# EasyEDA Pro project Example_3D Shell Design.eprj, board 3D Shell Example-A
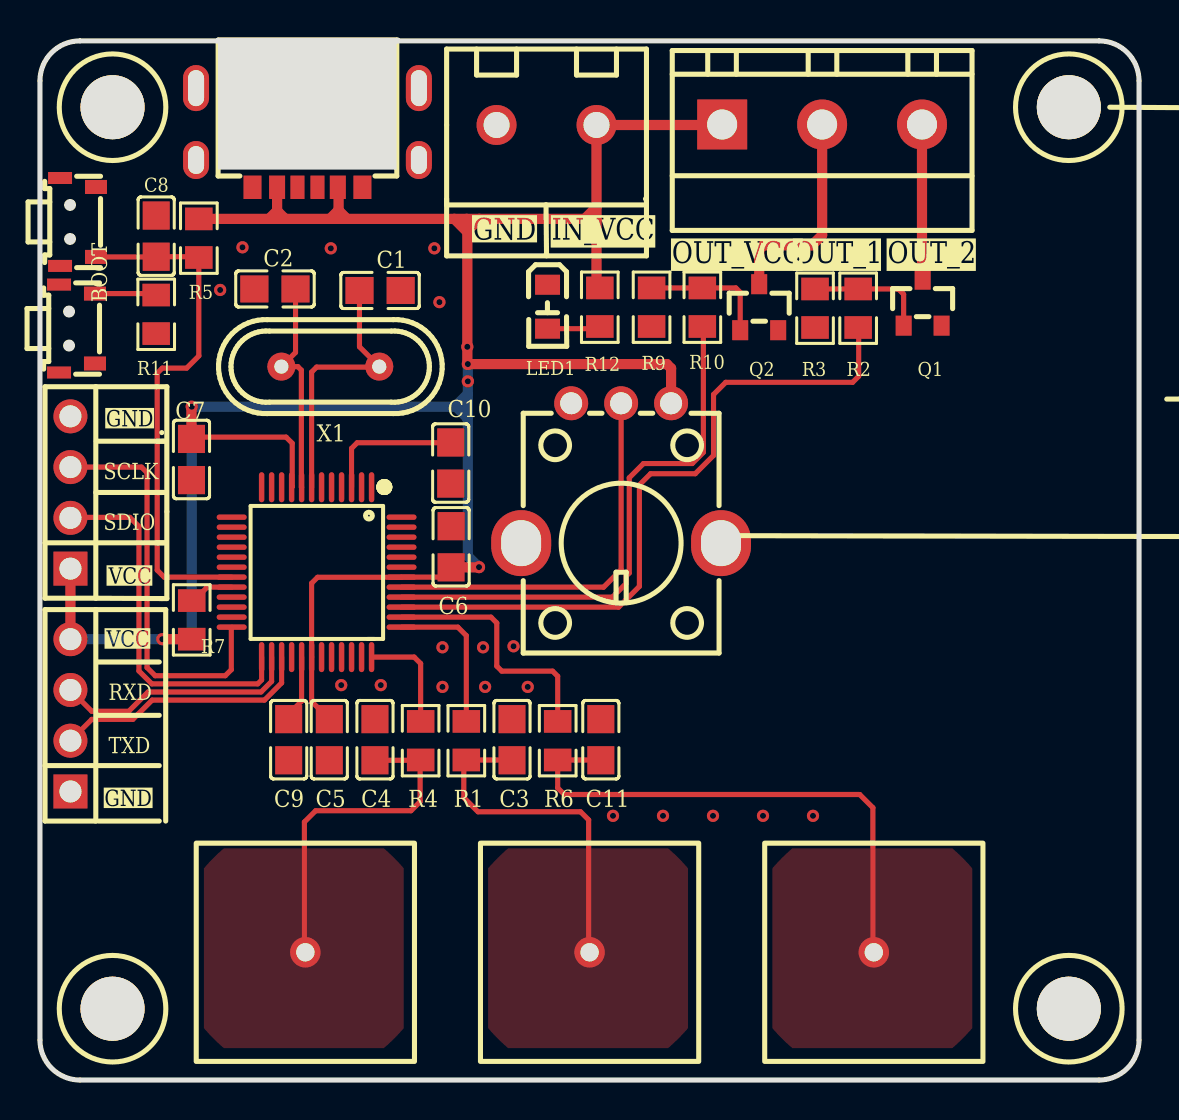
[diagram p2: board, top side]
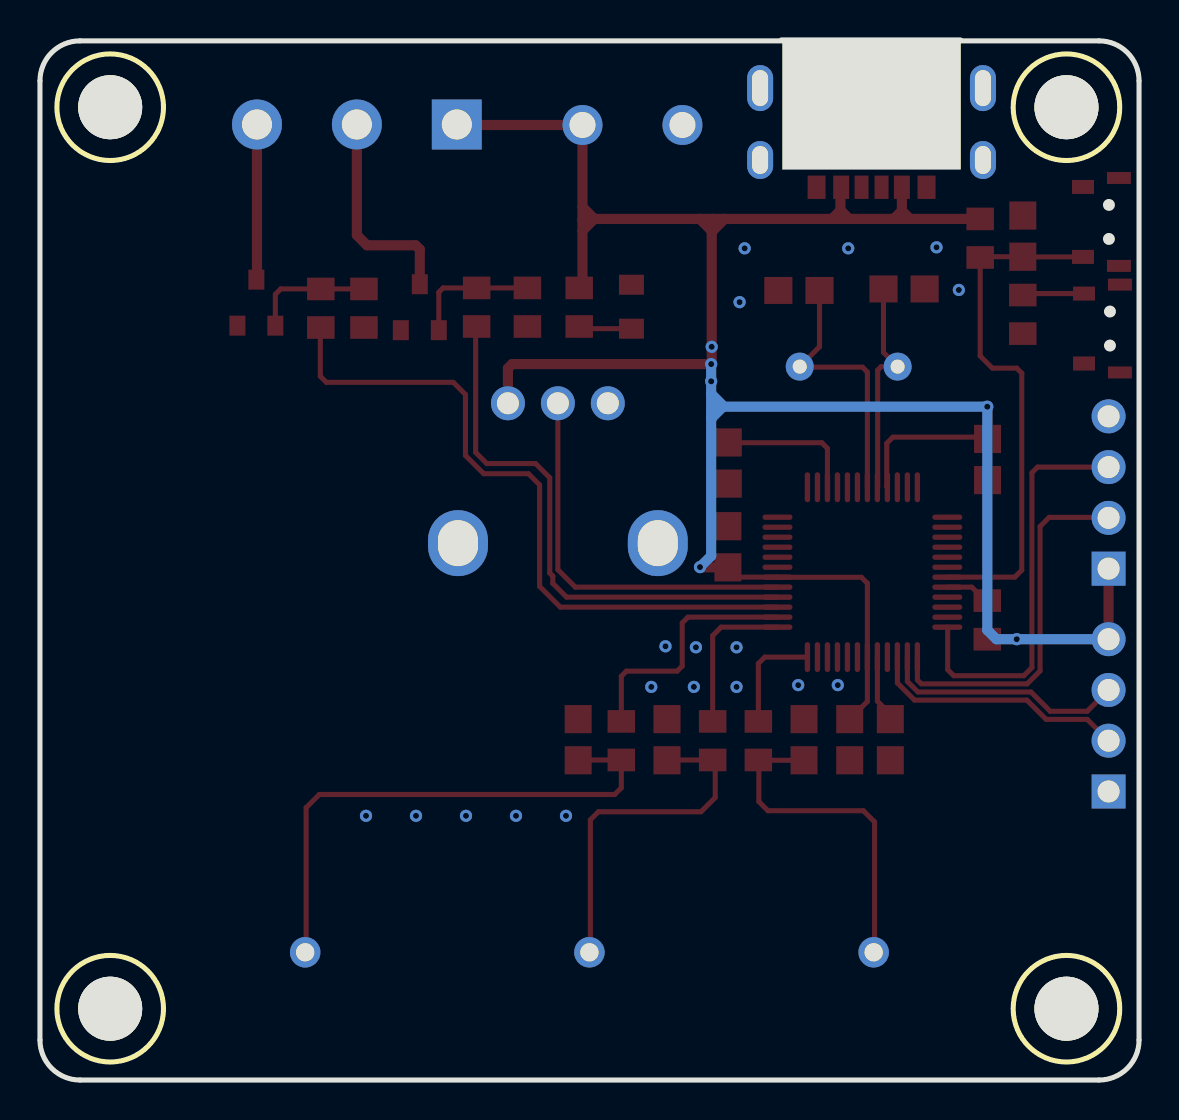
[diagram p3: board, bottom side, seen from below]

Outline 55 x 52.05 mm; copper layers: Top Layer, Bottom Layer. Coordinates in mm from the lower left corner of the outline.
Outline path: 0,50 0,2 arc(0.59,0.59) 2,0 53,0 arc(54.41,0.59) 55,2 55,50 arc(54.41,51.41) 53,52 2,52 arc(0.59,51.41) 0,50
Stack: Top Layer 0.035mm / 介电1 1.51mm FR4 er 4.5 / Bottom Layer 0.035mm

## Design rules (mm)
net TXD: DP1
net RXD: DP1
net SWDIO: DP2
net SWCLK: DP2
spacing Common (default): track to track 0.152, other pairs 0.152 to 0.3
track width Common (default): min 0.127, default 0.254, max 2.54
track width 电源: min 0.127, default 0.508, max 2.54
differential pair Common (default): width min 0.127, default 0.254, max 2.54; gap min 0.152, default 0.152
via Common (default): diameter min 0.5, default 0.61, max 10; hole min 0.3, default 0.305, max 6
net +5V uses 电源
net GND uses 电源

## Placement (name value [footprint] x y rotation side)
BOOT  -  [sw-smd_kh-2435-caj]  1.85 37.61 270 top
C1  12pF  [c0805]  17.02 39.51 0 top
C2  12pF  [c0805]  11.76 39.59 180 top
C3  22pF  [c0805]  23.62 17.03 270 top
C4  22pF  [c0805]  16.76 17.03 270 top
C5  100nF  [c0805]  14.48 17.03 270 top
C6  100nF  [c0805]  20.57 26.68 90 top
C7  100nF  [c0805]  7.58 31.05 270 top
C8  100nF  [c0805]  5.82 42.23 90 top
C9  100nF  [c0805]  12.45 17.03 270 top
C10  4.7uF  [c0805]  20.55 30.87 90 top
C11  22pF  [c0805]  28.07 17.03 270 top
H1  -  [hdr-th_4p-p2.54-v-m]  1.52 18.25 90 top
H2  -  [hdr-th_4p-p2.54-v-m]  1.52 29.4 90 top
J1  -  [触摸点]  41.68 6.57 0 top
J2  -  [触摸点]  13.23 6.57 0 top
J3  -  [触摸点]  27.46 6.57 0 top
LED1  -  [led0805-rd_red]  25.4 38.7 270 top
P2  -  [conn-th_wj126v-5.0-2p]  25.35 47.79 270 top
Q1  -  [sot-23_l2.9-w1.3-p1.90-ls2.4-br]  44.17 38.9 270 top
Q2  -  [sot-23_l2.9-w1.3-p1.90-ls2.4-br]  35.99 38.67 270 top
R1  510Ω  [r0805]  21.34 16.98 270 top
R2  100Ω  [r0805]  40.95 38.62 90 top
R3  100kΩ  [r0805]  38.79 38.62 90 top
R4  510Ω  [r0805]  19.05 16.98 270 top
R5  10kΩ  [r0805]  7.95 42.13 90 top
R6  510Ω  [r0805]  25.91 16.98 270 top
R7  10k  [r0805]  7.59 23.03 90 top
R8  10k  [res-th_rk09k1130a5r]  29.08 30.37 180 top
R9  100kΩ  [r0805]  30.61 38.67 90 top
R10  100Ω  [r0805]  33.15 38.67 90 top
R11  1.5k  [r0805]  5.82 38.32 90 top
R12  1k  [r0805]  28.02 38.67 90 top
SW1  RST  [sw-smd_kh-2435-caj]  1.91 42.94 270 top
TP1  -  [3m螺丝孔]  3.63 3.57 0 top
TP2  -  [3m螺丝孔]  51.49 3.57 0 top
TP3  -  [3m螺丝孔]  3.63 48.68 0 top
TP4  -  [3m螺丝孔]  51.49 48.68 0 top
U1  -  [lqfp-48_l7.0-w7.0-p0.50-ls9.0-bl]  13.84 25.41 180 top
U2  -  [conn-th_xy300v-a-5.0-3p]  39.14 47.82 0 top
USB1  -  [type-c-smd_type-c-31-m-28a]  13.39 47.16 180 top
X1  -  [osc-th_l11.1-w4.7-p4.88]  14.53 35.7 0 top

## Footprints (pads in the part's own frame, mm; a bottom-side part is the same pattern mirrored in y, then rotated)
3m螺丝孔
  round 3.2 hole 3.2: 1(0,0)
c0805
  rect 1.409x1.351 smd: 1(-1.028,0) 2(1.031,0)
conn-th_wj126v-5.0-2p
  round 1.999 hole 1.3: 1(0,2.502) 2(0,-2.499)
conn-th_xy300v-a-5.0-3p
  rect 2.499x2.499 hole 1.501: 1(-5.002,0)
  round 2.499 hole 1.501: 2(0,0) 3(4.998,0)
hdr-th_4p-p2.54-v-m
  rect 1.7x1.7 hole 1.1: 1(-3.81,0)
  round 1.7 hole 1.1: 2(-1.27,0) 3(1.27,0) 4(3.81,0)
led0805-rd_red
  rect 1.001x1.25 smd: 1(-1.1,0) 2(1.1,0)
lqfp-48_l7.0-w7.0-p0.50-ls9.0-bl
  oval 0.269x1.501 smd: 1(-2.751,-4.25) 2(-2.251,-4.25) 3(-1.75,-4.25) 4(-1.25,-4.25) 5(-0.75,-4.25) 6(-0.249,-4.25) 7(0.249,-4.25) 8(0.75,-4.25) 9(1.25,-4.25) 10(1.75,-4.25) 11(2.251,-4.25) 12(2.751,-4.25) 25(2.751,4.25) 26(2.251,4.25) 27(1.75,4.25) 28(1.25,4.25) 29(0.75,4.25) 30(0.249,4.25) 31(-0.249,4.25) 32(-0.75,4.25) 33(-1.25,4.25) 34(-1.75,4.25) 35(-2.251,4.25) 36(-2.751,4.25)
  oval 1.501x0.269 smd: 13(4.25,-2.751) 14(4.25,-2.251) 15(4.25,-1.75) 16(4.25,-1.25) 17(4.25,-0.75) 18(4.25,-0.249) 19(4.25,0.249) 20(4.25,0.75) 21(4.25,1.25) 22(4.25,1.75) 23(4.25,2.251) 24(4.25,2.751) 37(-4.25,2.751) 38(-4.25,2.251) 39(-4.25,1.75) 40(-4.25,1.25) 41(-4.25,0.75) 42(-4.25,0.249) 43(-4.25,-0.249) 44(-4.25,-0.75) 45(-4.25,-1.25) 46(-4.25,-1.75) 47(-4.25,-2.251) 48(-4.25,-2.751)
osc-th_l11.1-w4.7-p4.88
  round 1.399 hole 0.701: 1(-2.449,0) 2(2.451,0)
r0805
  rect 1.133x1.377 smd: 1(-0.965,0) 2(0.965,0)
res-th_rk09k1130a5r
  round 1.7 hole 1.1: 1(-2.499,-3.5) 2(0,-3.5) 3(2.499,-3.5)
  oval 2.999x3.3 hole 1.999x2.301: 4(5.002,3.5) 5(-4.998,3.5)
sot-23_l2.9-w1.3-p1.90-ls2.4-br
  rect 1.001x0.8 smd: 1(1.151,-0.95) 2(1.151,0.95) 3(-1.151,0)
sw-smd_kh-2435-caj
  rect 0.701x1.1 smd: 1(-1.75,0.899) 2(1.75,0.899)
  rect 0.6x1.199 smd: 3(2.2,-0.899) 4(-2.2,-0.899)
type-c-smd_type-c-31-m-28a
  oval 1.3x1.9 hole 0.8x1.399: 7(5.575,1.117) 8(-5.575,1.117)
  oval 1.3x2.301 hole 0.8x1.801: 9(-5.575,-2.482) 10(5.575,-2.482)
  rect 0.701x1.171 smd: A5(-0.5,2.482) B5(0.5,2.482)
  rect 0.8x1.171 smd: A9(1.519,2.482) B9(-1.519,2.482)
  rect 0.899x1.171 smd: A12(2.751,2.482) B12(-2.751,2.482)
触摸点
  round 1.524 hole 0.914: 1(0.047,-0.174)

## Nets
+5V: C5.1 C6.1 C7.1 H1.4 H2.1 P2.1 R5.2 R7.1 R8.1 R12.2 U1.9 U1.30 U1.42 U2.1 USB1.A9 USB1.B9
GND: C1.2 C2.2 C3.1 C4.1 C5.2 C6.2 C7.2 C8.2 C9.2 C10.1 C11.1 H1.1 H2.4 LED1.1 P2.2 Q1.2 Q2.2 R3.1 R8.3 R9.1 R11.1 SW1.1 U1.6 U1.31 U1.43 USB1.7 USB1.8 USB1.9 USB1.10 USB1.A12 USB1.B12
OUT_PWM1: R2.1
OUT_PWM2: R10.1 U1.40
P013: R6.1 U1.38
P014: R1.1 U1.37
P015: R4.1 U1.36
P201: R7.2 U1.20
P212: C2.1 U1.8 X1.1
P213: C1.1 U1.7 X1.2
RST: C8.1 R5.1 SW1.2 U1.19
RXD: H1.2 U1.27
SWCLK: H2.3 U1.24
SWDIO: H2.2 U1.25
T_PWM: R8.2 U1.41
TXD: H1.3 U1.26
$1N3855: C4.2 J2.1 R4.2
$1N4845: Q1.3 U2.3
$1N4846: Q1.1 R2.2 R3.2
$1N4918: C3.2 J3.1 R1.2
$1N13076: C10.2 U1.3
$1N13161: C9.1 U1.29
$1N13260: C11.2 J1.1 R6.2
$1N28787: LED1.2 R12.1
$1N30012: Q2.1 R9.2 R10.2
$1N30015: Q2.3 U2.2
$1N32957: BOOT.2
$1N35031: BOOT.1 R11.2

Pads without a net: BOOT 3 4; R8 4 5; SW1 3 4; TP1 1; TP2 1; TP3 1; TP4 1; U1 1 2 4 5 10 11 12 13 14 15 16 17 18 21 22 23 28 32 33 34 35 39 44 45 46 47 48; USB1 A5 B5

## Via types
v1: diameter 0.61, hole 0.305, Top Layer to Bottom Layer, 24 vias

## Routing (per net, layer and track width the routed paths; a pad name or vN(x,y) marks a point on that pad's centre or on a via; arc(x,y) is an arc through that point)
+5V: length 134.7
  Top Layer w0.254: C6.1 20.08,25.16 U1.42 18.09,25.16 13.89,25.16 13.59,24.86 U1.30 13.59,18.94 C5.1 ; U1.9 12.62,29.69 12.62,31.86 12.32,32.17 7.67,32.17 C7.1
  Top Layer w0.508: R8.1 31.58,35.61 31.37,35.83 21.39,35.83 v1(21.39,36.69) 21.39,42.44 ; v1(7.59,33.69) 7.58,33.68 C7.1 ; 21.39,42.44 21.39,42.49 ; 21.39,42.44 20.73,43.09 ; U2.1 34.11,47.79 P2.1 27.85,43.69 ; 27.26,43.09 27.81,43.09 27.85,43.06 ; 27.26,43.09 27.85,42.5 ; 27.26,43.09 27.85,43.69 ; 27.26,43.09 21.98,43.09 ; 21.39,42.49 21.98,43.09 ; 21.39,42.49 21.39,43.06 21.35,43.09 ; 27.85,42.5 27.85,43.06 ; 27.85,42.5 27.85,39.73 27.94,39.64 ; 20.73,43.09 15.36,43.09 ; 20.73,43.09 21.35,43.09 ; 15.36,43.09 14.94,43.51 14.94,43.53 ; 15.36,43.09 14.94,43.09 ; 6.17,22.06 v1(6.12,22.06) R7.1 ; 21.98,43.09 21.35,43.09 ; 11.87,43.5 11.87,43.09 ; 11.87,43.5 12.27,43.09 ; 11.87,43.5 11.87,44.32 ; 11.87,43.5 11.46,43.09 ; 12.27,43.09 11.46,43.09 ; 12.27,43.09 14.51,43.09 ; 27.85,43.06 27.85,43.69 ; 11.46,43.09 R5.2 ; C6.1 21.96,25.65 v1(21.97,25.67) ; 14.94,43.53 14.94,44.28 14.9,44.32 ; 14.94,43.53 14.94,43.09 ; 14.94,43.53 14.51,43.09 ; 14.51,43.09 14.94,43.09 ; H2.1 H1.4
  Bottom Layer w0.508: v1(21.97,25.67) 21.41,26.23 v1(21.41,34.96) v1(21.41,35.83) ; 21.41,34.34 20.79,33.72 21.34,33.18 21.41,33.18 ; H1.4 v1(6.12,22.06) 7.14,22.06 7.59,22.52 v1(7.59,33.69) 20.79,33.69
GND:
  vias: v1(9.02,39.54) v1(10.13,41.67) v1(14.55,41.62) v1(15.08,19.76) v1(17.06,19.76) v1(19.74,41.62) v1(19.99,38.93) v1(20.14,21.65) v1(20.14,19.67) v1(22.17,21.65) v1(22.28,19.67) v1(23.7,21.7) v1(24.41,19.67) v1(28.68,13.22) v1(31.18,13.22) v1(33.68,13.22) v1(36.18,13.22) v1(38.68,13.22)
OUT_PWM1: length 34.9
  Top Layer w0.254: 40.95,37.66 40.97,37.63 40.97,35.22 40.67,34.91 34.32,34.91 33.71,34.3 33.71,31.25 32.79,30.34 30.56,30.34 30,29.78 30,24.7 28.96,23.66 18.09,23.66
OUT_PWM2: length 27.4
  Top Layer w0.254: R10.1 33.2,37.66 33.2,31.41 32.64,30.85 30.2,30.85 29.49,30.14 29.49,25.37 29.34,25.22 29.34,24.85 28.65,24.16 U1.40
P013: length 12.3
  Top Layer w0.254: 25.91,18.2 25.91,20.21 25.65,20.46 23.11,20.46 22.86,20.71 22.86,22.87 22.57,23.16 U1.38
P014: length 7.5
  Top Layer w0.254: 21.34,18.2 21.34,22.24 20.91,22.66 U1.37
P015: length 5.2
  Top Layer w0.254: 19.05,18.2 19.05,20.84 18.73,21.16 U1.36
P201: length 2.3
  Top Layer w0.254: R7.2 7.7,23.99 8.37,24.66 U1.20
P212: length 11.9
  Top Layer w0.254: C2.1 12.79,36.41 X1.1 ; 12.08,35.67 11.55,35.67 11.52,35.7 ; 12.08,35.67 12.27,35.67 ; 12.08,35.67 12.9,35.7 13.08,35.52 13.08,29.67 U1.8
P213: length 13.4
  Top Layer w0.254: C1.1 15.99,36.69 16.86,35.82 ; 16.86,35.82 X1.2 ; 16.86,35.82 16.71,35.67 13.84,35.67 13.59,35.43 U1.7
RST: length 26.3
  Top Layer w0.254: SW1.2 5.81,41.19 C8.1 7.91,41.2 R5.1 7.95,36.23 7.34,35.62 6.12,35.62 5.87,35.37 5.87,25.51 6.22,25.16 U1.19
RXD: length 13.1
  Top Layer w0.254: H1.2 2.59,18.05 4.65,18.05 5.61,19.01 11.23,19.01 12.09,19.87 U1.27
SWCLK: length 20.3
  Top Layer w0.254: U1.24 9.58,22.64 9.58,20.54 9.27,20.23 5.77,20.23 5.36,20.64 5.36,30.39 5.08,30.67 H2.3
SWDIO: length 18.5
  Top Layer w0.254: H2.2 1.55,28.16 4.5,28.16 4.95,27.7 4.95,20.47 5.6,19.83 10.9,19.83 11.09,20.02 U1.25
T_PWM: length 19.7
  Top Layer w0.254: R8.2 29.08,25.54 28.21,24.66 U1.41
TXD: length 12.3
  Top Layer w0.254: H1.3 2.59,18.45 4.44,18.45 5.41,19.42 11.06,19.42 11.59,19.95 U1.26
$1N3855: length 17
  Top Layer w0.254: R4.2 19.03,16 18.88,16 ; C4.2 18.88,16 ; 18.88,16 19.02,15.86 19.02,13.93 18.57,13.48 13.8,13.48 13.23,12.91 13.23,6.57
$1N4845: length 7.9
  Top Layer w0.508: Q1.3 44.14,40.08 44.14,47.92
$1N4846: length 6.1
  Top Layer w0.254: 43.22,37.75 43.22,39.32 42.95,39.59 R2.2 R3.2
$1N4918: length 17.4
  Top Layer w0.254: 27.46,6.57 27.46,13.02 27.05,13.42 21.92,13.42 21.21,14.14 21.21,15.89 R1.2 23.61,16.02 C3.2
$1N13076: length 7
  Top Layer w0.254: U1.3 15.59,31.61 15.87,31.89 20.54,31.89 C10.2
$1N13161: length 3.1
  Top Layer w0.254: U1.29 13.09,18.96 12.45,18.31
$1N13260: length 26.8
  Top Layer w0.254: 41.68,6.57 41.68,13.63 41.02,14.29 26.24,14.29 25.91,14.62 R6.2 28.05,16.02 C11.2
$1N28787: length 2.6
  Top Layer w0.254: LED1.2 27.83,37.6 27.94,37.71
$1N30012: length 6.4
  Top Layer w0.254: Q2.1 35.04,39.42 34.82,39.64 R10.2 R9.2
$1N30015: length 10.7
  Top Layer w0.508: U2.2 39.14,42.28 38.63,41.77 36.2,41.77 35.99,41.57 Q2.3
$1N35031: length 3.1
  Top Layer w0.254: 2.75,39.36 5.74,39.36 R11.2

## Copper pours and planes (outline as drawn; the poured copper is in the pictures)
GND on Top Layer: -0.23,51.63 55.3,51.63 55.3,-0.14 -0.23,-0.14
GND on Bottom Layer: -0.01,52 54.89,52 54.89,-0.19 -0.01,-0.19
$1N3855 on Top Layer: 8.2,11.6 18.2,11.6 18.2,1.6 8.2,1.6
$1N4918 on Top Layer: 22.43,11.6 32.43,11.6 32.43,1.6 22.43,1.6
$1N13260 on Top Layer: 36.65,11.6 46.65,11.6 46.65,1.6 36.65,1.6

## Text on the board
Top Silkscreen Layer: Top Menu - Place - 3D Shell-Outline, or right-click the / Board Outline to convert to 3D Shell-Outline | The white line is the inner wall of the shell on the 3D shell, / which does not need to be placed manually before the 3D shell / is drawn The height of the inner wall can be changed in the border properties panel. | The blue circle is an M2 srew pillar | Select 3D shell-outline (green line) - right properties panel - top shell inner outline height | 1. Screw pillar will has a Stiffener, you can set is as false at property panel | You can add the slot region at top or bottom shell | The side datum line the reference line for decide the side slot / region direction, it need to be draw outside the borad outline | Add the slot region for the shell sides | Top Menu - Place - 3D Shell-Screw Pillar | 2. Currently, only M2, M3, M4,M5 and M6 screws can be used. / Other types of screws cannot be modified. | Top menu - Place - 3D Shell-Top/Bottom Solt Region | Before drawing the side slot region, you need to draw the datum line first | Top menu - Place - 3D Shell-Side Slot Region | The green line is to generate the 3D shell frame. A 3D shell needs / to be placed before drawing the 3D shell | GND | IN_VCC | OUT_VCC | OUT_1 | OUT_2 | 3D Shell - Top Shell Slot Region | 3D Shell-Side Solt Region | 3D Shell-Side Datum Line | 3D Shell-Screw Pillar | 3D Shell-Top Shell Inner Outline | 3D Shell - Outline | 3D Shell-Outline | 3D Shell Top Shell Innert Outline | How to Place: | How to Place | Top/Bottom Shell Solt Region | How to place | Notice | How to Set | SCLK | SDIO | VCC | RXD | TXD
